# EAGLE design GPV1 (EAGLE 7.6.0)

## Sheet 1 of 4: Power Supply Circuit
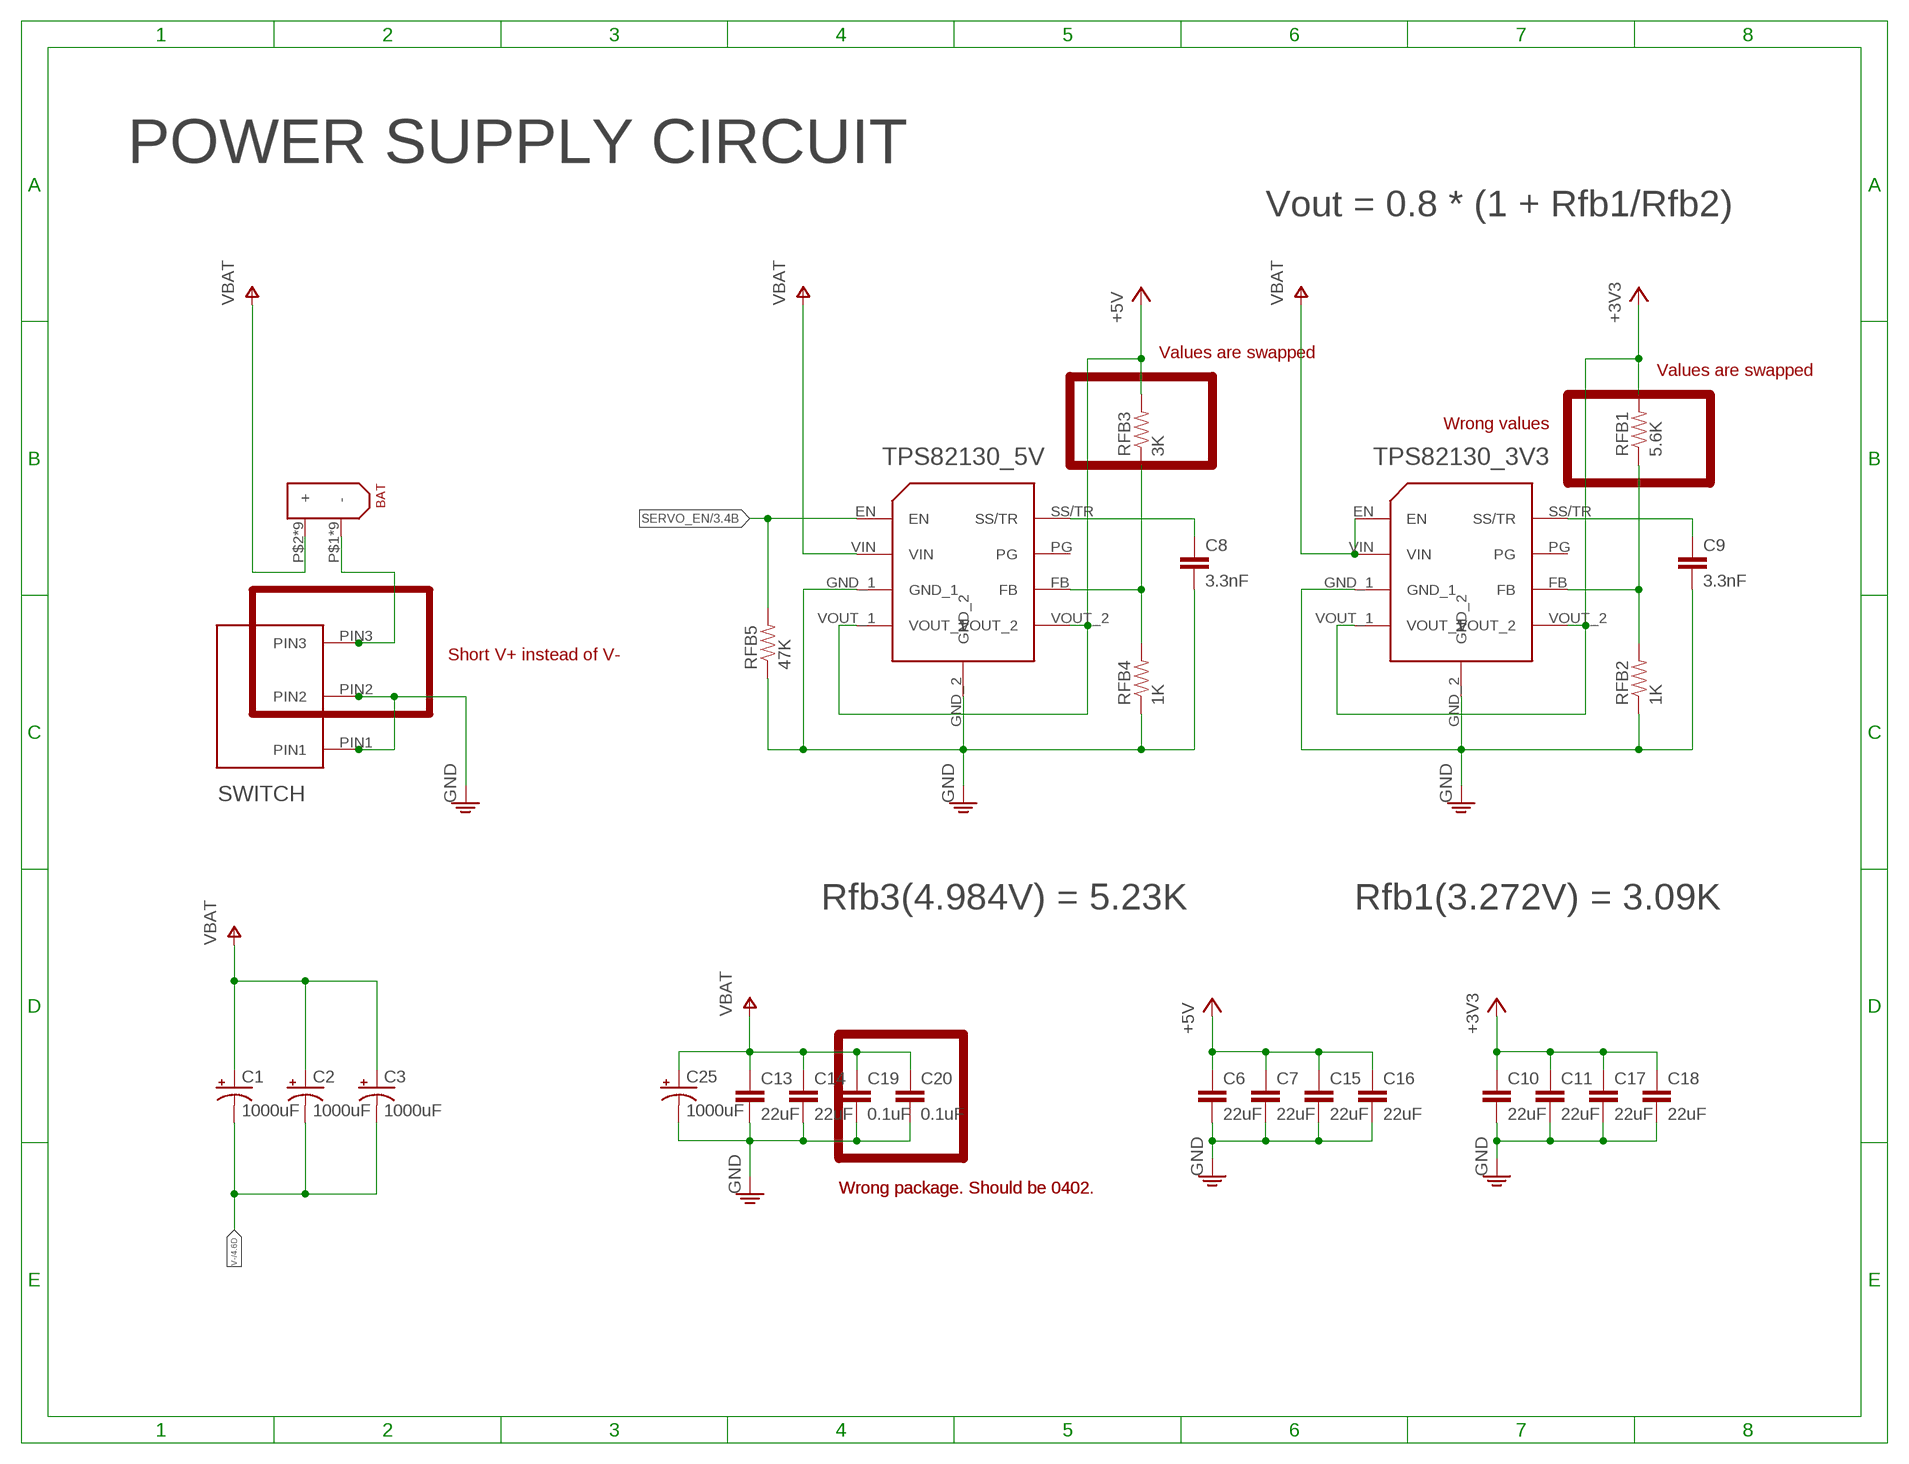
[diagram p0: schematic, sheet 1]

### Parts
BAT  XT-60  [XT-60]
C1  1000uF  CAP_POLH13  [PANASONIC_H13]
C2  1000uF  CAP_POLH13  [PANASONIC_H13]
C3  1000uF  CAP_POLH13  [PANASONIC_H13]
C6  22uF  CAP0805  [0805]
C7  22uF  CAP0805  [0805]
C8  3.3nF  CAP0402-CAP  [0402-CAP]
C9  3.3nF  CAP0402-CAP  [0402-CAP]
C10  22uF  CAP0805  [0805]
C11  22uF  CAP0805  [0805]
C13  22uF  CAP0805  [0805]
C14  22uF  CAP0805  [0805]
C15  22uF  CAP0805  [0805]
C16  22uF  CAP0805  [0805]
C17  22uF  CAP0805  [0805]
C18  22uF  CAP0805  [0805]
C19  0.1uF  CAP0805  [0805]
C20  0.1uF  CAP0805  [0805]
C25  1000uF  CAP_POLH13  [PANASONIC_H13]
ON<-->OFF  TS02_SWITCH  [TS02_SWITCH]
RFB1  5.6K  RESISTOR0402-RES  [0402-RES]
RFB2  1K  RESISTOR0402-RES  [0402-RES]
RFB3  3K  RESISTOR0402-RES  [0402-RES]
RFB4  1K  RESISTOR0402-RES  [0402-RES]
RFB5  47K  RESISTOR0402-RES  [0402-RES]
TPS82130_3V3  TPS82130  [TPS82130]
TPS82130_5V  TPS82130  [TPS82130]

### Nets
+3V3: C10.1 C11.1 C17.1 C18.1 RFB1.2 TPS82130_3V3.VOUT_1 TPS82130_3V3.VOUT_2 ; also sheet 2,3,4
+5V: C6.1 C7.1 C15.1 C16.1 RFB3.2 TPS82130_5V.VOUT_1 TPS82130_5V.VOUT_2 ; also sheet 3
GND: C6.2 C7.2 C8.2 C9.2 C10.2 C11.2 C13.2 C14.2 C15.2 C16.2 C17.2 C18.2 C19.2 C20.2 C25.- ON<-->OFF.PIN1 ON<-->OFF.PIN2 RFB2.1 RFB4.1 RFB5.1 TPS82130_3V3.GND_1 TPS82130_3V3.GND_2 TPS82130_5V.GND_1 TPS82130_5V.GND_2 ; also sheet 2,3,4
N$2: C9.1 TPS82130_3V3.SS/TR
N$16: RFB1.1 RFB2.2 TPS82130_3V3.FB
N$29: C8.1 TPS82130_5V.SS/TR
N$32: RFB3.1 RFB4.2 TPS82130_5V.FB
SERVO_EN: RFB5.2 TPS82130_5V.EN ; also sheet 3
V+: BAT.P$2(+) BAT.P$7(+) BAT.P$8(+) BAT.P$9(+) BAT.P$10(+) BAT.P$11(+) BAT.P$12(+) BAT.P$13(+) BAT.P$14(+) C1.+ C2.+ C3.+ C13.1 C14.1 C19.1 C20.1 C25.+ TPS82130_3V3.EN TPS82130_3V3.VIN TPS82130_5V.VIN ; supply symbol labelled VBAT ; also sheet 3,4
V-: BAT.P$1(-) BAT.P$3(-) BAT.P$4(-) BAT.P$5(-) BAT.P$6(-) BAT.P$15(-) BAT.P$16(-) BAT.P$17(-) BAT.P$18(-) C1.- C2.- C3.- ON<-->OFF.PIN3 ; also sheet 4
Unconnected: TPS82130_3V3.PG TPS82130_5V.PG

### Notes on the sheet
- POWER SUPPLY CIRCUIT
- Vout = 0.8 * (1 + Rfb1/Rfb2)
- Values are swapped
- Values are swapped
- Wrong values
- Short V+ instead of V-
- Rfb3(4.984V) = 5.23K | Rfb1(3.272V) = 3.09K
- Wrong package. Should be 0402 | Wrong package. Should be 0402.

## Sheet 2 of 4: Pushbuttons and LEDs
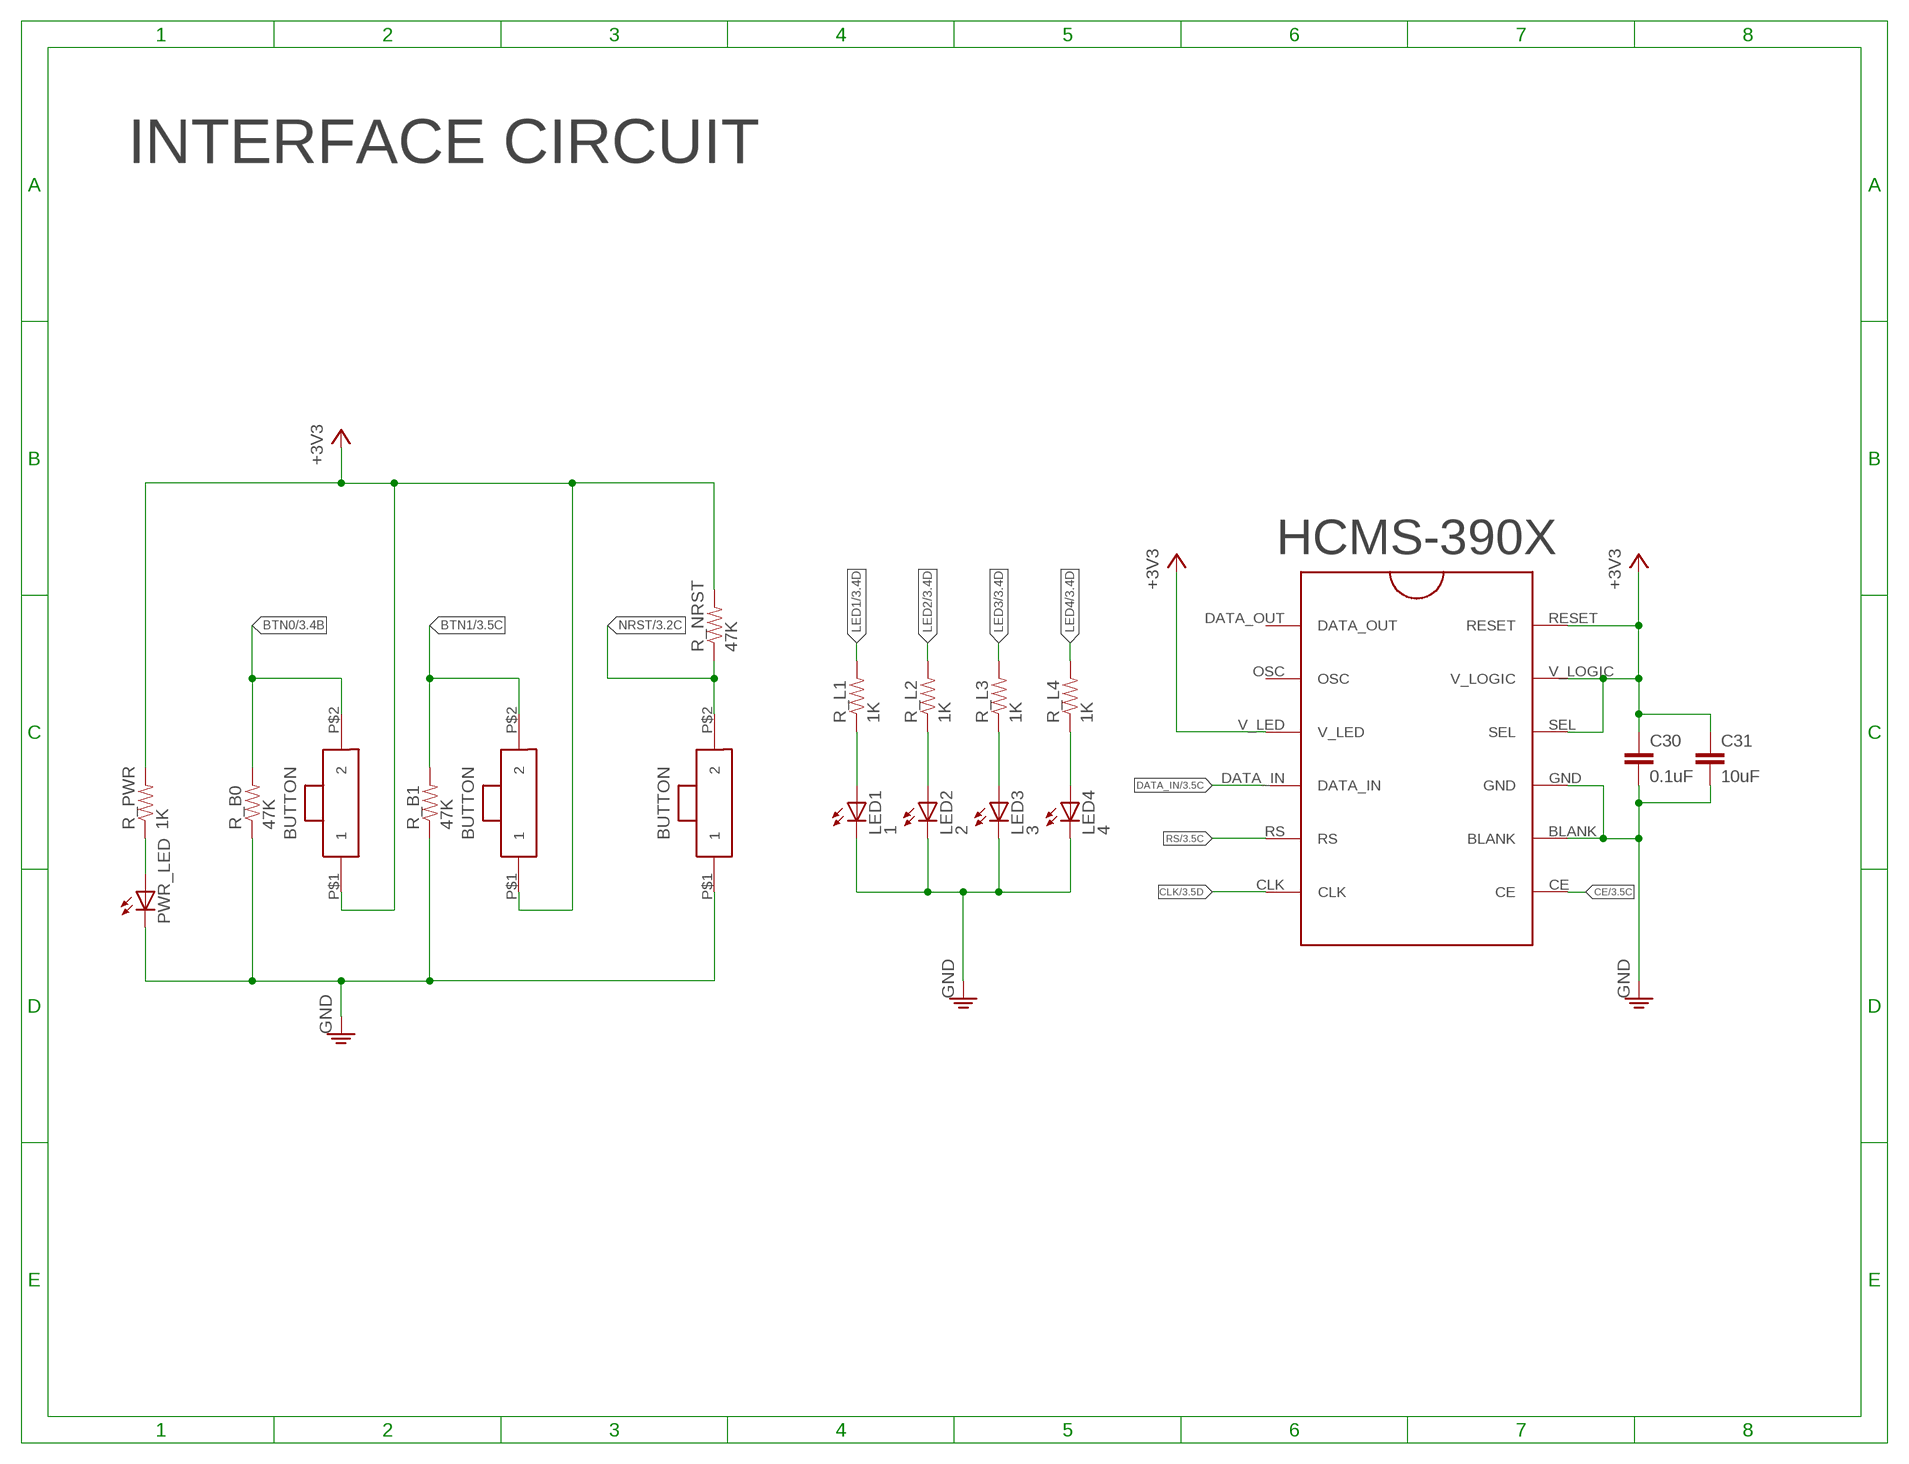
[diagram p1: schematic, sheet 2]

### Parts
BTN0  POLOLU_BUTTON  [POLOLU_BUTTON]
BTN1  POLOLU_BUTTON  [POLOLU_BUTTON]
C30  0.1uF  CAP0402-CAP  [0402-CAP]
C31  10uF  CAP0402-CAP  [0402-CAP]
HCMS-390X  HCMS-390X  HCMS-2903  [HCMS-2903]
LED1  1  LED0603  [LED-0603]
LED2  2  LED0603  [LED-0603]
LED3  3  LED0603  [LED-0603]
LED4  4  LED0603  [LED-0603]
PWR_LED  LED0603  [LED-0603]
R_B0  47K  RESISTOR0402-RES  [0402-RES]
R_B1  47K  RESISTOR0402-RES  [0402-RES]
R_L1  1K  RESISTOR0402-RES  [0402-RES]
R_L2  1K  RESISTOR0402-RES  [0402-RES]
R_L3  1K  RESISTOR0402-RES  [0402-RES]
R_L4  1K  RESISTOR0402-RES  [0402-RES]
R_NRST  47K  RESISTOR0402-RES  [0402-RES]
R_PWR  1K  RESISTOR0402-RES  [0402-RES]
RESET  NRST  POLOLU_BUTTON  [POLOLU_BUTTON]

### Nets
+3V3: BTN0.P$1 BTN1.P$1 C30.1 C31.1 HCMS-390X.RESET HCMS-390X.SEL HCMS-390X.V_LED HCMS-390X.V_LOGIC R_NRST.2 R_PWR.2 ; also sheet 1,3,4
BTN0: BTN0.P$2 R_B0.2 ; also sheet 3
BTN1: BTN1.P$2 R_B1.2 ; also sheet 3
CE: HCMS-390X.CE ; also sheet 3
CLK: HCMS-390X.CLK ; also sheet 3
DATA_IN: HCMS-390X.DATA_IN ; also sheet 3
GND: C30.2 C31.2 HCMS-390X.BLANK HCMS-390X.GND LED1.C LED2.C LED3.C LED4.C PWR_LED.C R_B0.1 R_B1.1 RESET.P$1 ; also sheet 1,3,4
LED1: R_L1.2 ; also sheet 3
LED2: R_L2.2 ; also sheet 3
LED3: R_L3.2 ; also sheet 3
LED4: R_L4.2 ; also sheet 3
N$1: PWR_LED.A R_PWR.1
N$4: LED1.A R_L1.1
N$7: LED2.A R_L2.1
N$8: LED3.A R_L3.1
N$11: LED4.A R_L4.1
NRST: R_NRST.1 RESET.P$2 ; also sheet 3
RS: HCMS-390X.RS ; also sheet 3
Unconnected: HCMS-390X.DATA_OUT HCMS-390X.OSC

### Notes on the sheet
- INTERFACE CIRCUIT

## Sheet 3 of 4: Microcontroller Circuit
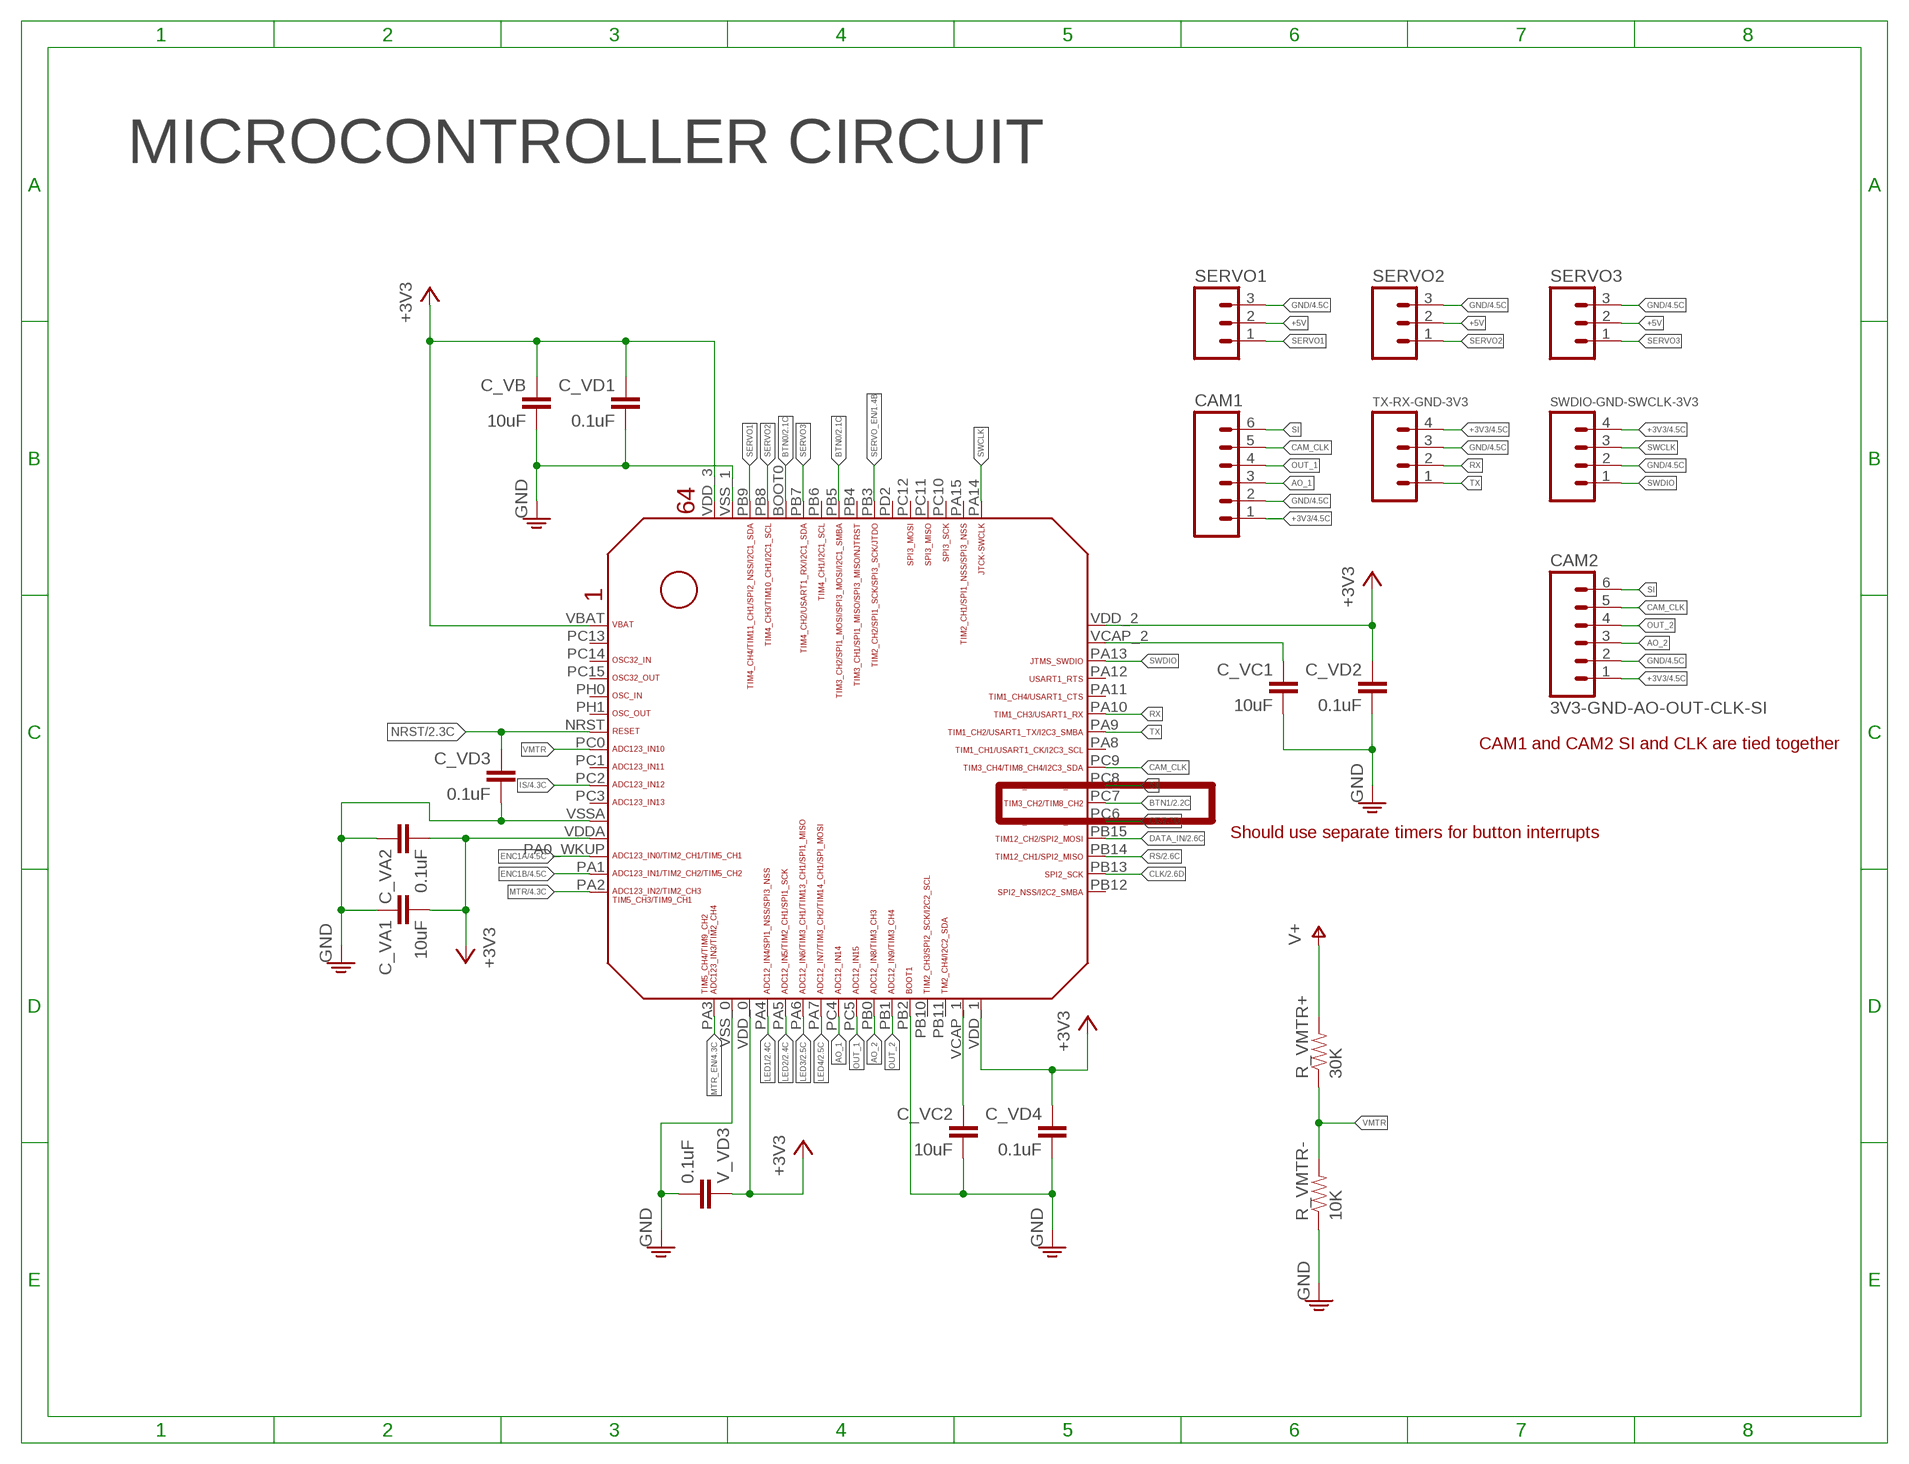
[diagram p2: schematic, sheet 3]

### Parts
C_VA1  10uF  CAP0402-CAP  [0402-CAP]
C_VA2  0.1uF  CAP0402-CAP  [0402-CAP]
C_VB  10uF  CAP0402-CAP  [0402-CAP]
C_VC1  10uF  CAP0402-CAP  [0402-CAP]
C_VC2  10uF  CAP0402-CAP  [0402-CAP]
C_VD1  0.1uF  CAP0402-CAP  [0402-CAP]
C_VD2  0.1uF  CAP0402-CAP  [0402-CAP]
C_VD3  0.1uF  CAP0402-CAP  [0402-CAP]
C_VD4  0.1uF  CAP0402-CAP  [0402-CAP]
CAM1  M06SIP  [1X06]
CAM2  3V3-GND-AO-OUT-CLK-SI  M06SIP  [1X06]
R_VMTR+  30K  RESISTOR0402-RES  [0402-RES]
R_VMTR-  10K  RESISTOR0402-RES  [0402-RES]
SERVO1  M03PTH  [1X03]
SERVO2  M03PTH  [1X03]
SERVO3  M03PTH  [1X03]
STM32F4X5RG  STM32F405/415_LQFP64  [STM32F405/415_LQFP64]
SWDIO-GND-SWCLK-3V3  M04PTH  [1X04]
TX-RX-GND-3V3  M04PTH  [1X04]
V_VD3  0.1uF  CAP0402-CAP  [0402-CAP]

### Nets
+3V3: C_VA1.2 C_VA2.2 C_VB.1 C_VD1.1 C_VD2.1 C_VD4.1 CAM1.1 CAM2.1 STM32F4X5RG.VBAT STM32F4X5RG.VDD_0 STM32F4X5RG.VDD_1 STM32F4X5RG.VDD_2 STM32F4X5RG.VDD_3 STM32F4X5RG.VDDA SWDIO-GND-SWCLK-3V3.4 TX-RX-GND-3V3.4 V_VD3.1 ; also sheet 1,2,4
+5V: SERVO1.2 SERVO2.2 SERVO3.2 ; also sheet 1
AO_1: CAM1.3 STM32F4X5RG.PC4
AO_2: CAM2.3 STM32F4X5RG.PB0
BTN0: STM32F4X5RG.BOOT0 STM32F4X5RG.PB5 ; also sheet 2
BTN1: STM32F4X5RG.PC7 ; also sheet 2
CAM_CLK: CAM1.5 CAM2.5 STM32F4X5RG.PC9
CE: STM32F4X5RG.PC6 ; also sheet 2
CLK: STM32F4X5RG.PB13 ; also sheet 2
DATA_IN: STM32F4X5RG.PB15 ; also sheet 2
ENC1A: STM32F4X5RG.PA0_WKUP(PA0_AKUP) ; also sheet 4
ENC1B: STM32F4X5RG.PA1 ; also sheet 4
GND: C_VA1.1 C_VA2.1 C_VB.2 C_VC1.2 C_VC2.2 C_VD1.2 C_VD2.2 C_VD3.2 C_VD4.2 CAM1.2 CAM2.2 R_VMTR-.1 SERVO1.3 SERVO2.3 SERVO3.3 STM32F4X5RG.PB2 STM32F4X5RG.VSS_0 STM32F4X5RG.VSS_1 STM32F4X5RG.VSSA SWDIO-GND-SWCLK-3V3.2 TX-RX-GND-3V3.3 V_VD3.2 ; also sheet 1,2,4
IS: STM32F4X5RG.PC2 ; also sheet 4
LED1: STM32F4X5RG.PA4 ; also sheet 2
LED2: STM32F4X5RG.PA5 ; also sheet 2
LED3: STM32F4X5RG.PA6 ; also sheet 2
LED4: STM32F4X5RG.PA7 ; also sheet 2
MTR: STM32F4X5RG.PA2 ; also sheet 4
MTR_EN: STM32F4X5RG.PA3 ; also sheet 4
N$64: C_VC2.1 STM32F4X5RG.VCAP_1
N$68: C_VC1.1 STM32F4X5RG.VCAP_2
NRST: C_VD3.1 STM32F4X5RG.NRST ; also sheet 2
OUT_1: CAM1.4 STM32F4X5RG.PC5
OUT_2: CAM2.4 STM32F4X5RG.PB1
RS: STM32F4X5RG.PB14 ; also sheet 2
RX: STM32F4X5RG.PA10 TX-RX-GND-3V3.2
SERVO1: SERVO1.1 STM32F4X5RG.PB9
SERVO2: SERVO2.1 STM32F4X5RG.PB8
SERVO3: SERVO3.1 STM32F4X5RG.PB7
SERVO_EN: STM32F4X5RG.PB3 ; also sheet 1
SI: CAM1.6 CAM2.6 STM32F4X5RG.PC8
SWCLK: STM32F4X5RG.PA14 SWDIO-GND-SWCLK-3V3.3
SWDIO: STM32F4X5RG.PA13 SWDIO-GND-SWCLK-3V3.1
TX: STM32F4X5RG.PA9 TX-RX-GND-3V3.1
V+: R_VMTR+.2 ; also sheet 1,4
VMTR: R_VMTR+.1 R_VMTR-.2 STM32F4X5RG.PC0
Unconnected: STM32F4X5RG.PA8 STM32F4X5RG.PA11 STM32F4X5RG.PA12 STM32F4X5RG.PA15 STM32F4X5RG.PB4 STM32F4X5RG.PB6 STM32F4X5RG.PB10 STM32F4X5RG.PB11 STM32F4X5RG.PB12 STM32F4X5RG.PC1 STM32F4X5RG.PC3 STM32F4X5RG.PC10 STM32F4X5RG.PC11 STM32F4X5RG.PC12 STM32F4X5RG.PC13 STM32F4X5RG.PC14 STM32F4X5RG.PC15 STM32F4X5RG.PD2 STM32F4X5RG.PH0 STM32F4X5RG.PH1

### Notes on the sheet
- MICROCONTROLLER CIRCUIT
- CAM1 and CAM2 SI and CLK are tied together
- Should use separate timers for button interrupts

## Sheet 4 of 4: Motor Control Circuit
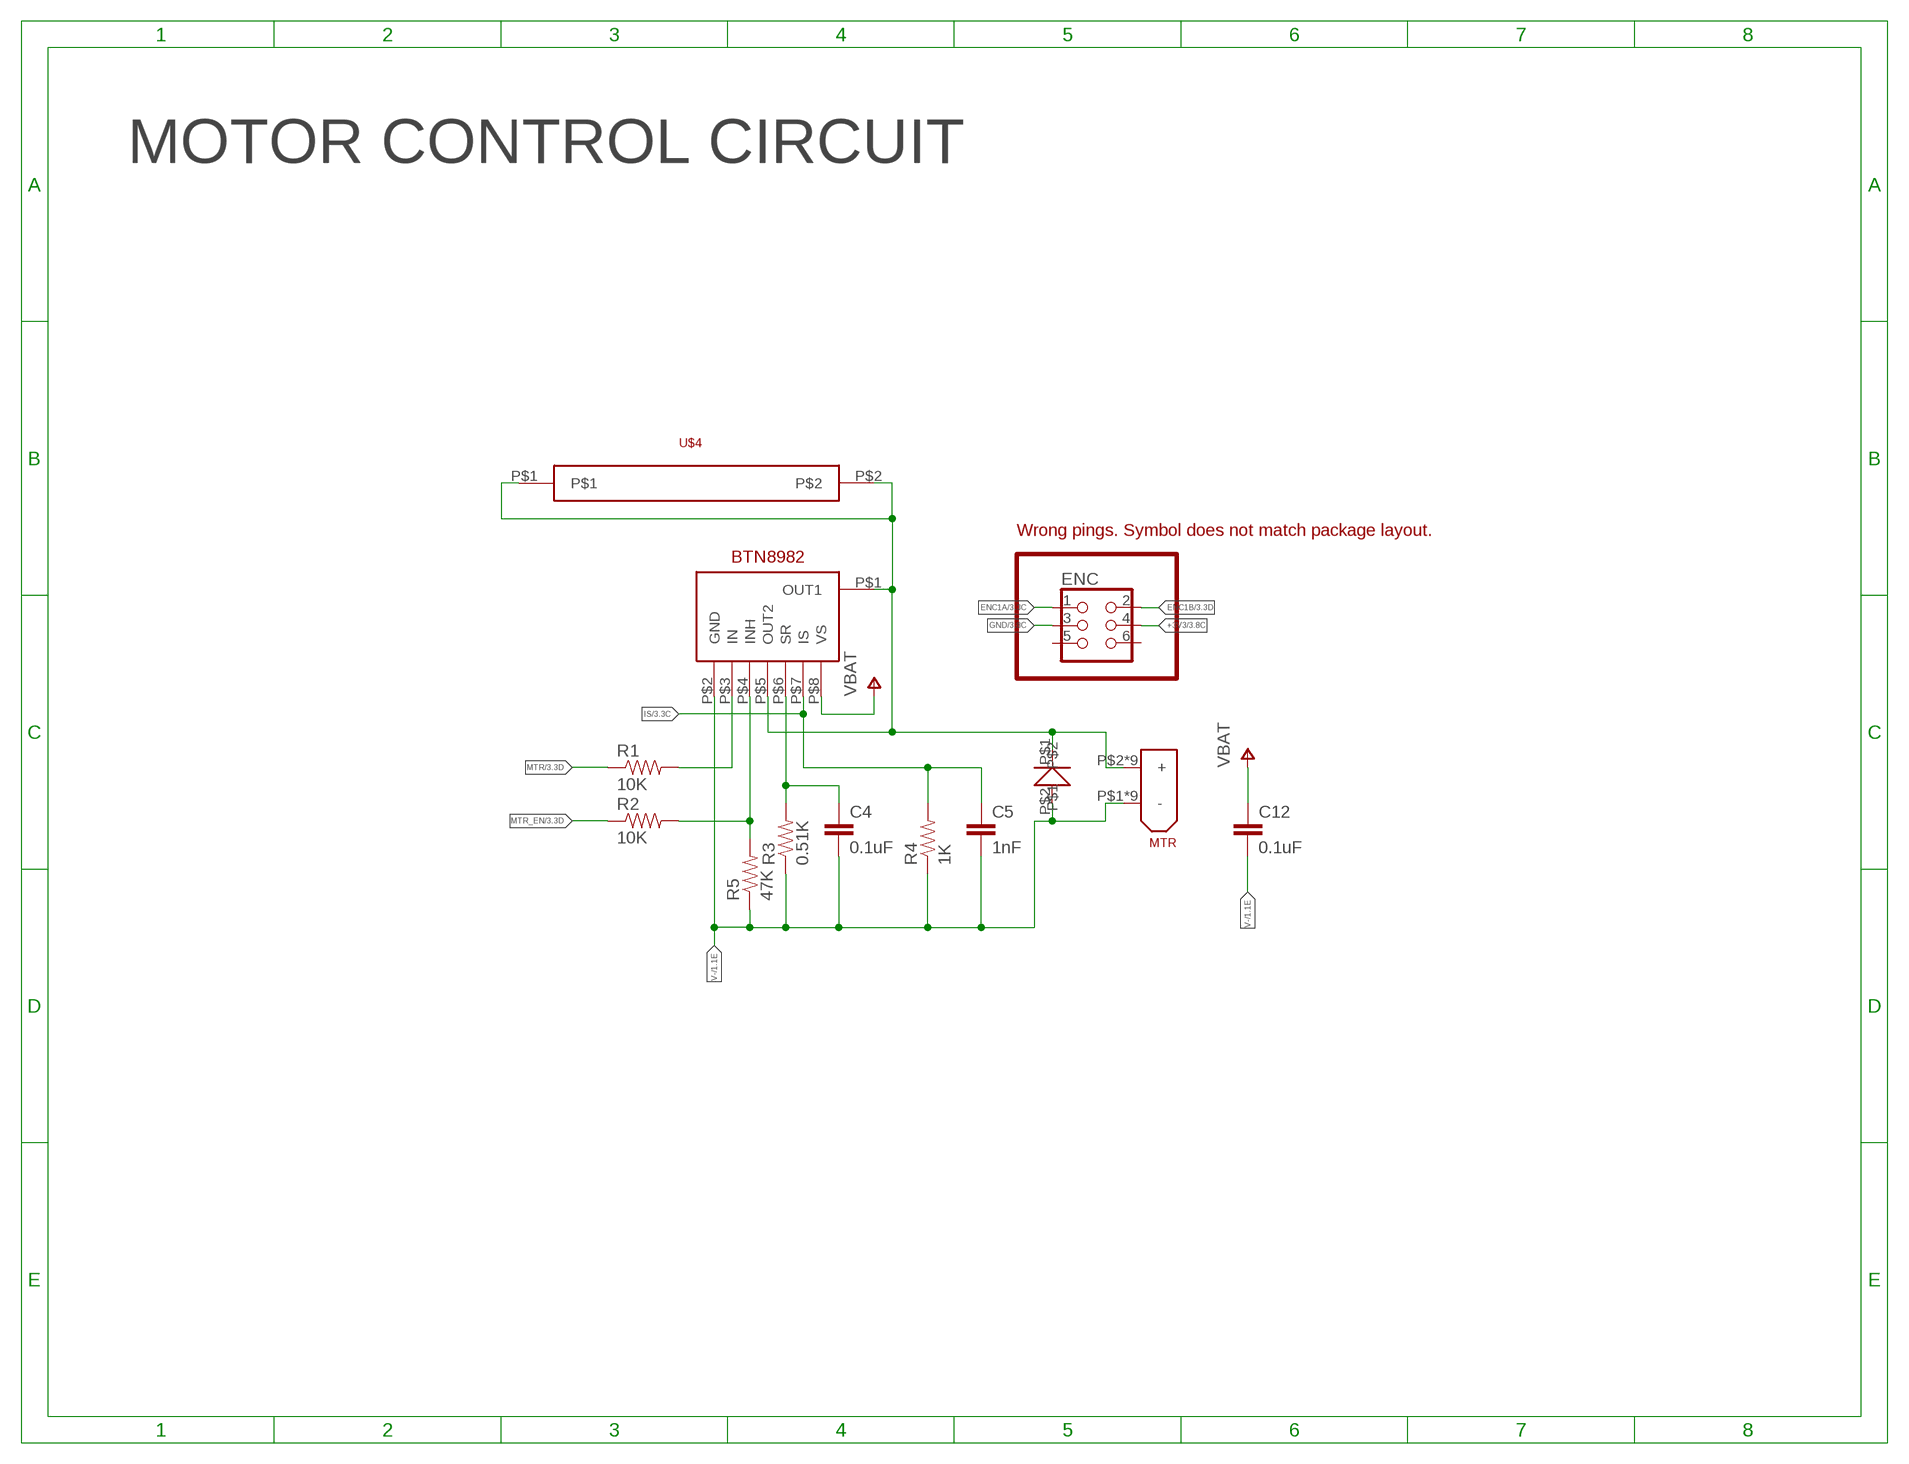
[diagram p3: schematic, sheet 4]

### Parts
BTN8982  BTN8982  [BTN8982]
C4  0.1uF  CAP0402-CAP  [0402-CAP]
C5  1nF  CAP0402-CAP  [0402-CAP]
C12  0.1uF  CAP0402-CAP  [0402-CAP]
DIODE  DIODE_DO-214AB  [DO-214AB]
ENC  PINHD-2X31  [DIN-41651]
MTR  XT-60  [XT-60]
R1  10K  RESISTOR0402-RES  [0402-RES]
R2  10K  RESISTOR0402-RES  [0402-RES]
R3  0.51K  RESISTOR0402-RES  [0402-RES]
R4  1K  RESISTOR0402-RES  [0402-RES]
R5  47K  RESISTOR0402-RES  [0402-RES]
U$4  HEATSINK_TO-263  [HEATSINK_TO-263]

### Nets
+3V3: ENC.4 ; also sheet 1,2,3
ENC1A: ENC.1 ; also sheet 3
ENC1B: ENC.2 ; also sheet 3
GND: ENC.3 ; also sheet 1,2,3
IS: BTN8982.P$7(IS) C5.1 R4.2 ; also sheet 3
MTR: R1.1 ; also sheet 3
MTR_EN: R2.1 ; also sheet 3
N$3: BTN8982.P$3(IN) R1.2
N$5: BTN8982.P$4(INH) R2.2 R5.2
N$6: BTN8982.P$6(SR) C4.1 R3.2
N$10: BTN8982.P$1(OUT1) BTN8982.P$5(OUT2) DIODE.P$1 MTR.P$2(+) MTR.P$7(+) MTR.P$8(+) MTR.P$9(+) MTR.P$10(+) MTR.P$11(+) MTR.P$12(+) MTR.P$13(+) MTR.P$14(+) U$4.P$1 U$4.P$2
V+: BTN8982.P$8(VS) C12.1 ; supply symbol labelled VBAT ; also sheet 1,3
V-: BTN8982.P$2(GND) C4.2 C5.2 C12.2 DIODE.P$2 MTR.P$1(-) MTR.P$3(-) MTR.P$4(-) MTR.P$5(-) MTR.P$6(-) MTR.P$15(-) MTR.P$16(-) MTR.P$17(-) MTR.P$18(-) R3.1 R4.1 R5.1 ; also sheet 1
Unconnected: ENC.5 ENC.6

### Notes on the sheet
- MOTOR CONTROL CIRCUIT
- Wrong pings. Symbol does not match package layout.

## Library data of the parts
BAT MTR = XT-60:XT-60
BTN0 BTN1 RESET = POLOLU BUTTON:POLOLU_BUTTON
BTN8982 = BTN8982:BTN8982
C1-C3 C25 = SPARKFUN:CAP_POL: Capacitor Polarized These are standard SMD and PTH capacitors. Normally 10uF, 47uF, and 100uF in electrolytic and tantalum varieties. Always verify the external diameter of the through hole cap, it varies with capacity, voltage, and manufacturer. The EIA devices should be standard.
C4-C20 C30 C31 C_VA1 C_VA2 C_VB C_VC1 C_VC2 C_VD1-C_VD4 V_VD3 = SPARKFUN:CAP: Capacitor Standard 0603 ceramic capacitor, and 0.1" leaded capacitor.
CAM1 CAM2 = SPARKFUN:M06: Header 6 Standard 6-pin 0.1" header. Use with straight break away headers (SKU : PRT-00116), right angle break away headers (PRT-00553), swiss pins (PRT-00743), machine pins (PRT-00117), and female headers (PRT-00115). Molex polarized connector foot print use with SKU : PRT-08094 with associated crimp pins and housings. NOTES ON THE VARIANTS LOCK and LOCK_LONGPADS... This footprint was designed to help hold the alignment of a through-hole component (i.e. 6-pin header) while soldering it into place. You may notice that each hole has been shifted either up or down by 0.005 of an inch from it's more standard position (which is a perfectly straight line). This slight alteration caused the pins (the squares in the middle) to touch the edges of the holes. Because they are alternating, it causes a "brace" to hold the component in place. 0.005 has proven to be the perfect amount of "off-center" position when using our standard breakaway headers. Although looks a little odd when you look at the bare footprint, once you have a header in there, the alteration is very hard to notice. Also, if you push a header all the way into place, it is covered up entirely on the bottom side. This idea of altering the position of holes to aid alignment will be further integrated into the Sparkfun Library for other footprints. It can help hold any component with 3 or more connection pins.
DIODE = DIODE_DO-214AB:DIODE_DO-214AB
ENC = SPARKFUN:PINHD-2X3: PIN HEADER
HCMS-390X = HCMS-2903:HCMS-2903
LED1-LED4 PWR_LED = SPARKFUN:LED: LEDs Standard schematic elements and footprints for 5mm, 3mm, 1206, and 0603 sized LEDs. 5mm - Spark Fun Electronics SKU : COM-00529 (and others)
ON<-->OFF = SLIDE SWITCH 0.185 PITCH:TS02_SWITCH
R1-R5 R_B0 R_B1 R_L1-R_L4 R_NRST R_PWR R_VMTR+ R_VMTR- RFB1-RFB5 = SPARKFUN:RESISTOR: Resistor Basic schematic elements and footprints for 0603, 1206, and PTH resistors.
SERVO1-SERVO3 = SPARKFUN:M03: Header 3 Standard 3-pin 0.1" header. Use with straight break away headers (SKU : PRT-00116), right angle break away headers (PRT-00553), swiss pins (PRT-00743), machine pins (PRT-00117), and female headers (PRT-00115). Molex polarized connector foot print use with SKU : PRT-08232 with associated crimp pins and housings.
STM32F4X5RG = STM32F405RG:STM32F405/415_LQFP64
SWDIO-GND-SWCLK-3V3 TX-RX-GND-3V3 = SPARKFUN:M04: Header 4 Standard 4-pin 0.1" header. Use with straight break away headers (SKU : PRT-00116), right angle break away headers (PRT-00553), swiss pins (PRT-00743), machine pins (PRT-00117), and female headers (PRT-00115). Molex polarized connector foot print use with SKU : PRT-08231 with associated crimp pins and housings. 1MM SMD Version SKU: PRT-10208
TPS82130_3V3 TPS82130_5V = TPS82130:TPS82130
U$4 = HEATSINK_TO-263:HEATSINK_TO-263

## Board
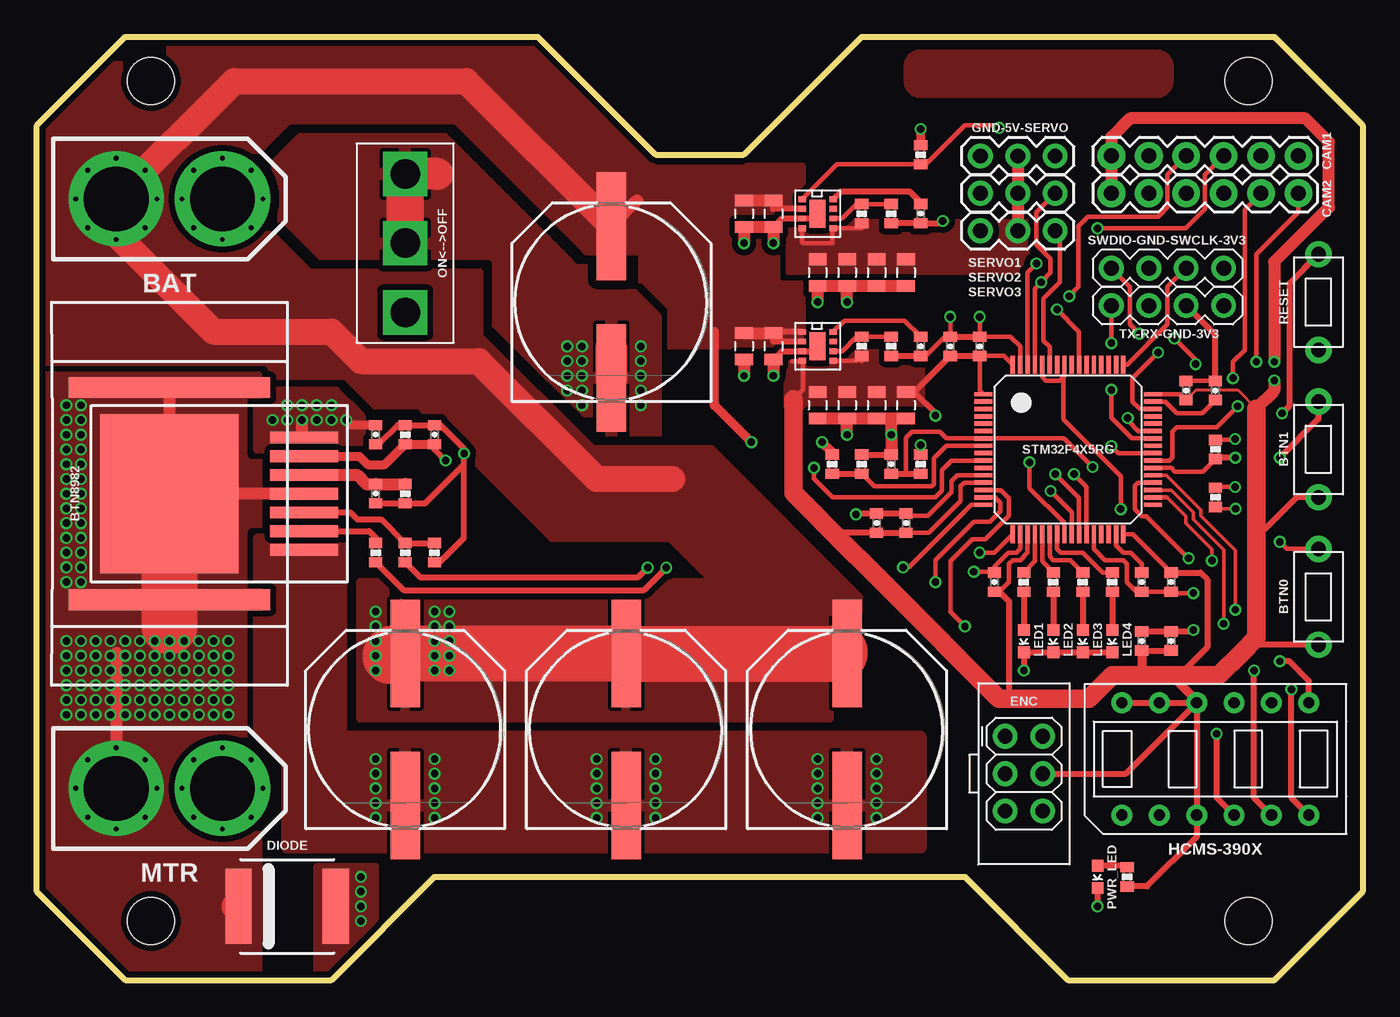
[diagram p4: board, top side]
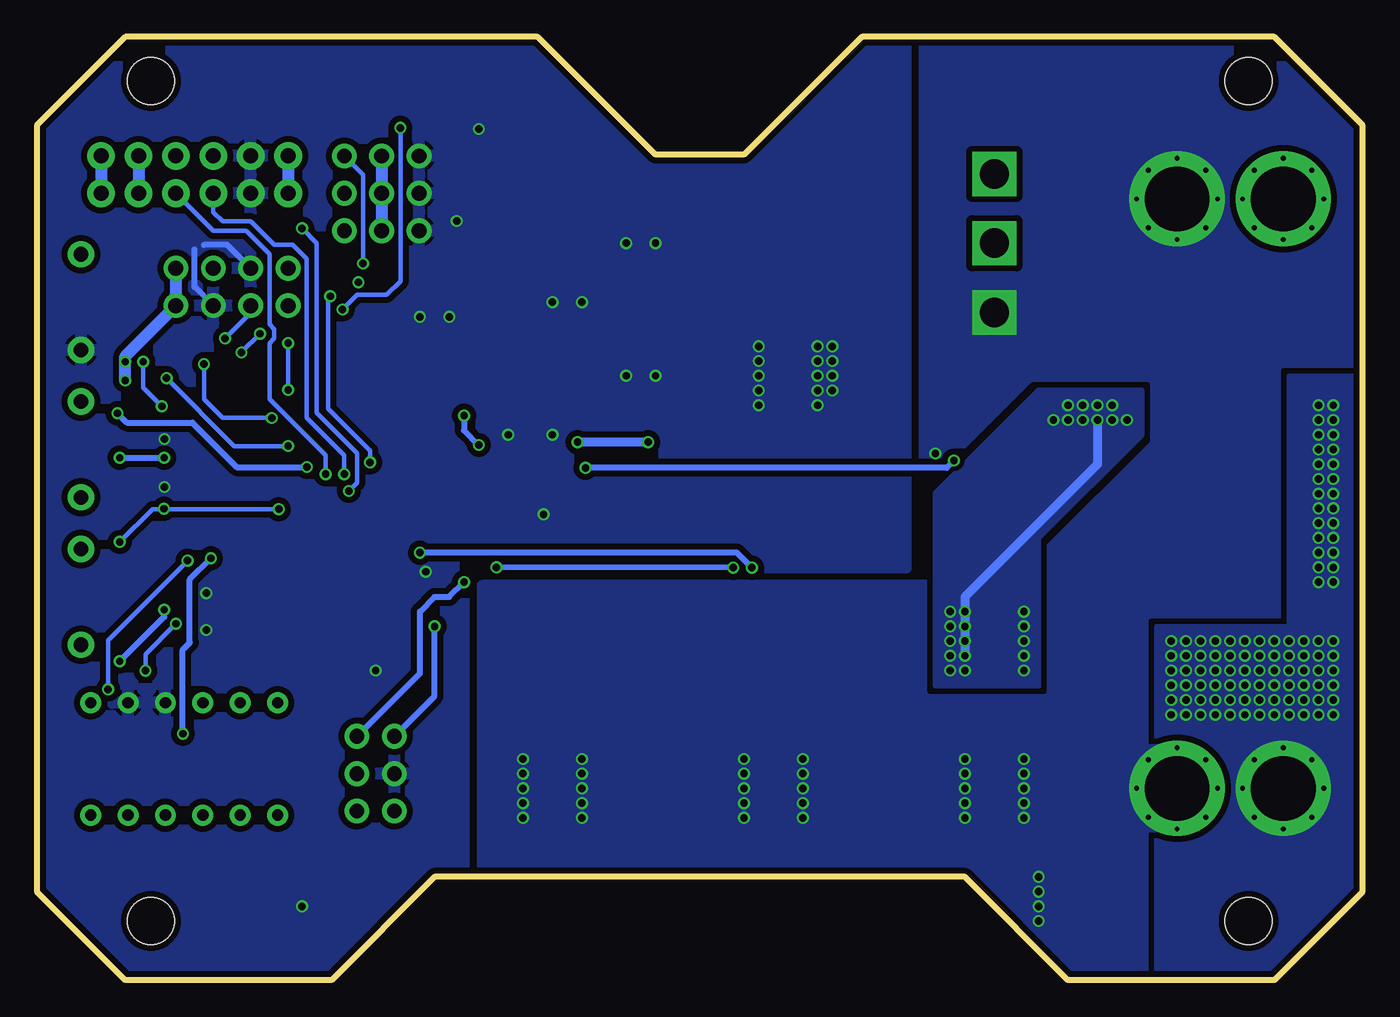
[diagram p5: board, bottom side, seen from below]

Size 90 x 64 mm. Coordinates in mm from the lower left corner, seen from the top.
Outline: 90,58 90,6 84,0 70,0 63,7 27,7 20,0 6,0 0,6 0,58 6,64 34,64 42,56 48,56 56,64 84,64 90,58
Copper layers (1*16): Top 0.035mm / dielectric 1.5mm / Bottom 0.035mm
Design rules "ITead_rule": minimum track width 6mil, minimum drill 12mil, track to track 6mil, track to pad 6mil, pad to pad 6mil, via to via 6mil, smd to smd 0mil, copper to edge 10mil, drill to drill 10mil, minimum pad ring 10mil, minimum via ring 6mil, stop-mask expansion 2mil, vias tented up to drill 100mil, thermal gap 10mil
Holes 3.2 mm at 7.75,61 82.25,61 7.75,4 82.25,4

### Footprints (pad centres in the part's own frame; a part is rotated, then mirrored left to right if it is on the bottom)
XT-60 = drill 4.4 pad 6.452: P$1 0,3.6; P$2 0,-3.6 | drill 0.33: P$3 2.75,3.6; P$4 -2.75,3.6; P$5 0,6.35; P$6 0,0.85; P$7 2.75,-3.6; P$8 -2.75,-3.6; P$9 0,-0.85; P$10 0,-6.35; P$11 1.945,-1.655; P$12 -1.945,-5.545; P$13 -1.945,-1.655; P$14 1.945,-5.545; P$15 1.945,5.545; P$16 -1.945,1.655; P$17 -1.945,5.545; P$18 1.945,1.655
POLOLU_BUTTON = drill 1 pad 1.778: P$1 -3.25,0; P$2 3.25,0
BTN8982 = smd 10.8 x 9.4: P$1 0,0 | smd 0.8 x 4.6: P$2 -3.81,-9.15; P$3 -2.54,-9.15; P$4 -1.27,-9.15; P$5 0,-9.15; P$6 1.27,-9.15; P$7 2.54,-9.15; P$8 3.81,-9.15
PANASONIC_H13 = smd 7.3 x 2: + 5.15,0; - -5.15,0
0402-CAP = smd 0.7 x 0.9: 1 -0.65,0; 2 0.65,0
0805 = smd 0.8 x 1.2: 1 -0.9,0; 2 0.9,0
1X06 = drill 1.016 pad 1.88: 1 0,0; 2 2.54,0; 3 5.08,0; 4 7.62,0; 5 10.16,0; 6 12.7,0
DO-214AB = smd 1.778 x 5.08: P$1 -3.302,0; P$2 3.302,0
DIN-41651 = drill 1 pad 1.676: 1 -2.54,-1.27; 2 -2.54,1.27; 3 0,-1.27; 4 0,1.27; 5 2.54,-1.27; 6 2.54,1.27
HCMS-2903 = drill 0.762 pad 1.422: BLANK 3.81,3.81; CE 6.35,3.81; CLK 6.35,-3.81; DATA_IN 1.27,-3.81; DATA_OUT -6.35,-3.81; GND 1.27,3.81; OSC -3.81,-3.81; RESET -6.35,3.81; RS 3.81,-3.81; SEL -1.27,3.81; V_LED -1.27,-3.81; V_LOGIC -3.81,3.81
LED-0603 = smd 0.8 x 0.8: A 0,-0.75; C 0,0.75
TS02_SWITCH = drill 2 square: PIN1 -4.699,0; PIN2 0,0; PIN3 4.699,0
0402-RES = smd 0.7 x 0.9: 1 -0.65,0; 2 0.65,0
1X03 = drill 1 pad 1.676: 1 0,0; 2 2.54,0; 3 5.08,0
STM32F405/415_LQFP64 = smd 0.3 x 1.2: BOOT0 -1.75,5.75; PA3 -3.75,-5.75; PA4 -2.25,-5.75; PA5 -1.75,-5.75; PA6 -1.25,-5.75; PA7 -0.75,-5.75; PA14 3.75,5.75; PA15 3.25,5.75; PB0 0.75,-5.75; PB1 1.25,-5.75; PB2 1.75,-5.75; PB3 0.75,5.75; PB4 0.25,5.75; PB5 -0.25,5.75; PB6 -0.75,5.75; PB7 -1.25,5.75; PB8 -2.25,5.75; PB9 -2.75,5.75; PB10 2.25,-5.75; PB11 2.75,-5.75; PC4 -0.25,-5.75; PC5 0.25,-5.75; PC10 2.75,5.75; PC11 2.25,5.75; PC12 1.75,5.75; PD2 1.25,5.75; VCAP_1 3.25,-5.75; VDD_0 -2.75,-5.75; VDD_1 3.75,-5.75; VDD_3 -3.75,5.75; VSS_0 -3.25,-5.75; VSS_1 -3.25,5.75 | smd 1.2 x 0.3: NRST -5.75,0.75; PA0_WKUP -5.75,-2.75; PA1 -5.75,-3.25; PA2 -5.75,-3.75; PA8 5.75,0.25; PA9 5.75,0.75; PA10 5.75,1.25; PA11 5.75,1.75; PA12 5.75,2.25; PA13 5.75,2.75; PB12 5.75,-3.75; PB13 5.75,-3.25; PB14 5.75,-2.75; PB15 5.75,-2.25; PC0 -5.75,0.25; PC1 -5.75,-0.25; PC2 -5.75,-0.75; PC3 -5.75,-1.25; PC6 5.75,-1.75; PC7 5.75,-1.25; PC8 5.75,-0.75; PC9 5.75,-0.25; PC13 -5.75,3.25; PC14 -5.75,2.75; PC15 -5.75,2.25; PH0 -5.75,1.75; PH1 -5.75,1.25; VBAT -5.75,3.75; VCAP_2 5.75,3.25; VDD_2 5.75,3.75; VDDA -5.75,-2.25; VSSA -5.75,-1.75
1X04 = drill 1.016 pad 1.676: 1 0,0; 2 2.54,0; 3 5.08,0; 4 7.62,0
TPS82130 = smd 0.5 x 0.4: EN -1.05,0.975; FB 1.05,-0.325; GND_1 -1.05,-0.325; PG 1.05,0.325; SS/TR 1.05,0.975; VIN -1.05,0.325; VOUT_1 -1.05,-0.975; VOUT_2 1.05,-0.975 | smd 1.1 x 1.9: GND_2 0,0
HEATSINK_TO-263 = smd 1.4 x 13.7: P$1 -7.2,0; P$2 7.2,0

### Placement (x,y rotation side)
BAT  9,53 270 top
BTN0  87,26 90 top
BTN1  87,36 90 top
BTN8982  9,33 90 top
C1  25,17 90 top
C2  55,17 90 top
C3  40,17 90 top
C4  23,33 270 top
C5  27,37 90 top
C6  53,48 270 top
C7  55,48 270 top
C8  60,52 270 top
C9  60,43 270 top
C10  53,39 270 top
C11  55,39 270 top
C12  23,37 270 top
C13  48,43 270 top
C14  48,52 270 top
C15  57,48 270 top
C16  59,48 270 top
C17  57,39 270 top
C18  59,39 270 top
C19  50,52 270 top
C20  50,43 270 top
C25  39,46 90 top
C30  75,23 90 top
C31  77,23 90 top
C_VA1  57,31 270 top
C_VA2  59,31 270 top
C_VB  62,43 90 top
C_VC1  80,40 90 top
C_VC2  75,27 270 top
C_VD1  64,43 90 top
C_VD2  78,40 90 top
C_VD3  58,35 90 top
C_VD4  77,27 270 top
CAM1  72.94,55.92 0 top
CAM2  72.94,53.38 0 top
DIODE  17,5 0 top
ENC  67,14 270 top
HCMS-390X  80,15 0 top
LED1  67,23 180 top
LED2  69,23 180 top
LED3  71,23 180 top
LED4  73,23 180 top
MTR  9,13 270 top
ON<-->OFF  25,50 270 top
PWR_LED  72,7 180 top
R1  23,29 90 top
R2  25,29 90 top
R3  25,33 90 top
R4  25,37 270 top
R5  27,29 90 top
R_B0  80,32.75 270 top
R_B1  80,36 270 top
R_L1  67,27 90 top
R_L2  69,27 90 top
R_L3  71,27 90 top
R_L4  73,27 90 top
R_NRST  60,35 90 top
R_PWR  74,7 270 top
R_VMTR+  54,35 90 top
R_VMTR-  56,35 270 top
RESET  87,46 90 top
RFB1  56,43 270 top
RFB2  58,43 90 top
RFB3  56,52 270 top
RFB4  58,52 90 top
RFB5  60,56 270 top
SERVO1  69.13,55.92 180 top
SERVO2  69.13,53.38 180 top
SERVO3  69.13,50.84 180 top
STM32F4X5RG  70,36 0 top
SWDIO-GND-SWCLK-3V3  72.94,48.3 0 top
TPS82130_3V3  53,43 0 top
TPS82130_5V  53,52 0 top
TX-RX-GND-3V3  72.94,45.76 0 top
U$4  9,33 90 top
V_VD3  65,27 90 top

### Tracks (layer width: path | path; a pad name or v marks a point on that pad's centre or on a via)
+3V3  (via drill 0.5)
  Top 0.203: C_VD2.1 78.69,40.05 81.51,40.05 82.78,38.77
  Top 0.305: TPS82130_3V3.VOUT_1 51.98,42 | 51.98,42 52,42 52,40.06 51.35,39.41 | 54,42 54.02,42 TPS82130_3V3.VOUT_2 55.67,42.02 RFB1.2 56,42 | 51.98,42 51.25,42 | STM32F4X5RG.VDD_1 74.4,30.25 C_VD4.1 | STM32F4X5RG.VDD_0 67.25,29 66.75,28.5 66.25,28.5 66,28.25 66,27 65.35,26.35 V_VD3.1 | STM32F4X5RG.VDD_3 65.65,42.35 C_VD1.1 64,40 STM32F4X5RG.VBAT | C_VD2.1 77.6,39.75 STM32F4X5RG.VDD_2 | STM32F4X5RG.VDDA 62.95,33.75 62.7,33.5 62.7,32.5 60.55,30.35 C_VA2.2
  Top 0.406: R_PWR.2 75.35,6.35 78.73,9.73 HCMS-390X.V_LED HCMS-390X.SEL | C30.1 C31.1 | HCMS-390X.SEL HCMS-390X.V_LOGIC HCMS-390X.RESET | ENC.4 73.92,14 HCMS-390X.SEL | BTN0.P$1 82.31,22.75 81.78,22.22 | BTN1.P$1 85.53,32.75 82.78,30 | C18.1 59.55,39.9 | 59.55,39.9 C_VB.1 C_VD1.1 | 52.76,31.65 52.7,31.7 | C_VA2.2 C_VA1.2 54.06,30.35 53.7,30.7 | 82.78,36.37 82.78,36 | 58.06,26.35 57.7,26.7 | R_NRST.2 v60,36.3 | 59.55,39.9 61,38.45 v61,38.3 | 65.35,26.35 66,25.7 66,19.09 | C_VD4.1 78.98,27.65 79.45,27.19 79.45,22.58 77.54,20.68
  Top 0.61: C30.1 75,20.68 | HCMS-390X.SEL 78.73,18.95 77,20.68
  Top 0.813: v84,41.95 84,48.72 87.7,52.43 87.7,56.87 86.12,58.46 74.21,58.46 72.94,57.19 CAM2.1 | v84,40.68 84,40 82.78,38.78 82.78,38.77
  Top 1.27: 51.35,39.41 51.35,33.06 52.7,31.7 53.7,30.7 57.7,26.7 65.32,19.09 66,19.09 71.42,19.09 73.01,20.68 75,20.68 77,20.68 77.54,20.68 80.24,20.68 81.78,22.22 82.78,23.22 82.78,30 82.78,36 82.78,38.77
  Bottom 0.406: v61,38.3 61,37.3 v60,36.3
  Bottom 0.813: CAM1.1 CAM2.1 | SWDIO-GND-SWCLK-3V3.4 TX-RX-GND-3V3.4 84,42.32 v84,41.95 v84,40.68
  pour Top (isolate 0.406, no thermals): 51,42.5 51,39 60,39 60,42.5
+5V
  Top 0.305: TPS82130_5V.VOUT_1 51.95,50.05 52,50 54,50 54,51 | TPS82130_5V.VOUT_2 55.98,51.02 56,51
  Top 0.813: 66.6,55.9 66.6,50.8
  Bottom 0.813: SERVO1.2 SERVO2.2 SERVO3.2
  pour Top (isolate 0.406, no thermals): 51,51.5 68,51.5 68,48 51,48
AO_1  (via drill 0.5)
  Top 0.305: CAM1.3 76.75,54.65 76.75,52.43 76.11,51.79 71.35,51.79 70.72,51.16 70.72,47.03 v70.08,46.39 | v67.38,35.12 67.38,33.38 69.75,31.01 STM32F4X5RG.PC4
  Bottom 0.305: v70.08,46.39 70.24,46.24 70.24,38.77 67.38,35.92 v67.38,35.12
AO_2  (via drill 0.5)
  Top 0.305: STM32F4X5RG.PB0 70.75,32.71 v69.13,34.33
  Bottom 0.305: v69.13,34.33 69.13,35.6 71.67,38.14 71.67,48.94 72.62,49.89 73.89,49.89 75.48,51.48 77.38,51.48 78.02,52.11 CAM2.3
BTN0  (via drill 0.5)
  Top 0.254: v81.37,31.98 80.12,31.98 R_B0.2
  Top 0.305: STM32F4X5RG.BOOT0 68.25,40.92 68.5,40.68 69.45,40.68 69.69,40.92 | STM32F4X5RG.PB5 69.75,40.98 69.69,40.92 | BTN0.P$2 84.85,29.25 v84.37,29.73 | v73.58,31.95 73.58,34.17 69.69,38.06 69.69,40.92
  Bottom 0.254: 82.15,31.95 81.4,31.95 v81.37,31.98
  Bottom 0.305: v84.37,29.73 82.15,31.95 v73.58,31.95
BTN1  (via drill 0.5)
  Top 0.305: R_B1.2 79.15,34.5 77.25,34.5 77,34.75 STM32F4X5RG.PC7
  Top 0.406: BTN1.P$2 87,38.07 v84.37,35.44 | v81.35,35.44 80.09,35.44 R_B1.2
  Bottom 0.406: v84.37,35.44 v81.35,35.44
CAM_CLK  (via drill 0.5)
  Top 0.305: CAM2.5 81.99,52.27 81.99,42.74 81.19,41.95 v81.19,40.84 | v72.94,36.23 73.42,35.75 STM32F4X5RG.PC9
  Bottom 0.305: v81.19,40.84 76.59,36.23 v72.94,36.23
  Bottom 0.813: CAM1.5 CAM2.5
CE  (via drill 0.5)
  Top 0.254: v81.35,25.12 81.35,29.15 79,31.5 79,31.92 76.67,34.25 STM32F4X5RG.PC6
  Top 0.406: HCMS-390X.CE 86.35,20.28 85,21.63 v84.37,21.63
  Bottom 0.406: v84.37,21.63 81.35,24.65 v81.35,25.12
CLK  (via drill 0.5)
  Top 0.254: 76.72,32.75 78,31.47 78,31 79.77,29.23 v79.77,28.46
  Top 0.305: 76.72,32.75 STM32F4X5RG.PB13
  Top 0.406: HCMS-390X.CLK 85.16,12.38 v85.16,19.73
  Bottom 0.305: v85.16,19.73 85.16,23.06 v79.77,28.46
DATA_IN  (via drill 0.5)
  Top 0.305: v78.18,28.62 75.32,31.47 75,31.47 74.53,31.95 74.53,33.54 74.74,33.75 STM32F4X5RG.PB15
  Top 0.406: HCMS-390X.DATA_IN 80.08,12.38 v80.08,16.71
  Bottom 0.406: v80.08,16.71 80.08,22.42 79.61,22.9 79.61,27.19 v78.18,28.62
ENC1A  (via drill 0.5)
  Top 0.305: v63,24 62,25 62,28.4 63.5,29.9 64.4,29.9 66,31.5 66,32.7 65.45,33.25 STM32F4X5RG.PA0_WKUP
  Bottom 0.406: ENC.1 63,19.27 v63,24
ENC1B  (via drill 0.5)
  Top 0.305: v61,27 61,28.5 63.6,31.1 64.7,31.1 65.4,31.8 65.4,32.4 65.05,32.75 STM32F4X5RG.PA1
  Bottom 0.406: ENC.2 64,20.81 64,25 63,26 62,26 v61,27
GND  (via drill 0.5)
  Top 0.305: STM32F4X5RG.PB2 71.75,29.25 72.5,28.5 73.75,28.5 74,28.25 74,27 74.65,26.35 C_VC2.2 C_VD4.2 77.1,26.25 v78.5,26.25 | STM32F4X5RG.VSS_0 66.75,29.25 66.5,29 65.95,29 65,28.05 V_VD3.2 64.95,27.7 v63.6,27.7 | STM32F4X5RG.VSS_1 66.75,43 66.1,43.65 C_VD1.2 64,43.75 v64,45 | C_VB.2 v62,45 | 61.85,43.5 C_VB.2 | C_VB.2 61.65,43.65 60.35,42.35 C9.2 | C_VC1.2 C_VD2.2 | STM32F4X5RG.VSSA 62.5,34.25 62.1,33.85 62.1,33.1 60.5,31.5 59.15,31.5 C_VA2.1 | v81.33,36.71 81.28,36.65 R_B1.1 | R_B0.1 80.06,33.46 v81.33,33.46
  Top 0.406: LED4.C LED3.C LED2.C LED1.C v67,21 | PWR_LED.C v72,5 | v78.5,23.75 78.4,23.65 C31.2 C30.2 | RFB4.1 C8.2 61.35,51.35 v61.5,51.5 | TPS82130_5V.GND_2 52.67,51.67 TPS82130_5V.GND_1 50.58,51.67 C19.2 | C20.2 50.58,42.67 TPS82130_3V3.GND_1 52.67,42.67 TPS82130_3V3.GND_2 | RFB2.1 C9.2 | C_VB.2 63.9,43.65 64,43.75 | R_VMTR-.1 C_VD3.2 | C_VA2.1 C_VA1.1 55.65,31.65 v55.6,31.6 | C_VC1.2 80,43.78 TX-RX-GND-3V3.3
  Top 0.61: RFB5.1 v60,57.75
  Top 0.813: C18.2 58,38.1 | 58,38.1 C17.2 C11.2 C10.2 | v55,37 55,38 | v53,46 C6.2 C7.2 | v55,46 C7.2 | C7.2 C15.2 C16.2 | C13.2 v48,41 | C20.2 v50,41 | v48,50 C14.2 C19.2 v50,50 | 58,38.1 v58,37 C_VD3.2
  Top 2.184: C25.- 39,42.87 | 27.17,54.7 ON<-->OFF.PIN1
  Top 2.54: ON<-->OFF.PIN1 ON<-->OFF.PIN2
  Bottom 0.406: TX-RX-GND-3V3.3 79.29,47.03 79.29,49.57 | SWDIO-GND-SWCLK-3V3.2 77.07,49.89 78.66,49.89
  other vias: 41,43 41,42 41,41 41,40 41,39 37,43 37,42 37,41 37,40 37,39 36,43 36,42 36,41 36,40
  pour Bottom (isolate 0.406): 31,66 93,66 93,-2 61,-2 61,28 31,28
  pour Top (isolate 0.61, rank 4): 15,58 29,58 42,45 42,36 28,36 15,49
IS  (via drill 0.5)
  Top 0.305: STM32F4X5RG.PC2 62.1,35.25 61.45,34.6 61.45,33.2 61,32.75 54,32.75 52.75,34 v52.75,34.75
  Top 0.406: C5.1 27,36 v27.75,35.25
  Top 0.61: BTN8982.P$7 21.88,35.54 22.46,34.97 23.61,34.97 R4.2 C5.1
  Bottom 0.406: v27.75,35.25 28.25,34.75 v52.75,34.75
LED1
  Top 0.305: R_L1.2 67.75,28.4 STM32F4X5RG.PA4
LED2
  Top 0.305: R_L2.2 68.25,28.4 STM32F4X5RG.PA5
LED3
  Top 0.305: R_L3.2 70.15,28.5 69,28.5 68.75,28.75 STM32F4X5RG.PA6
LED4
  Top 0.305: STM32F4X5RG.PA7 69.25,29.25 69.5,29 71,29 72.35,27.65 R_L4.2
MTR  (via drill 0.5)
  Top 0.305: STM32F4X5RG.PA2 63.45,32.25 59.2,28 v58.8,28
  Top 0.406: R1.1 24.89,26.46 41.21,26.46 v42.73,27.98
  Bottom 0.406: v42.73,27.98 v58.8,28
MTR_EN  (via drill 0.5)
  Top 0.305: STM32F4X5RG.PA3 65,29 v64,29
  Top 0.406: R2.1 26,27.34 40.83,27.34 v41.46,27.98
  Bottom 0.406: v41.46,27.98 42.48,29 v64,29
N$1
  Top 0.406: R_PWR.1 73.9,7.75 PWR_LED.A
N$2
  Top 0.305: TPS82130_3V3.SS/TR 54.83,44.75 58.9,44.75 C9.1
N$3
  Top 0.406: BTN8982.P$3 22.54,30.46 23,30 R1.2
N$4
  Top 0.406: R_L1.1 LED1.A
N$5
  Top 0.406: BTN8982.P$4 21.27,31.73 21.75,31.25 23.4,31.25 R2.2 R5.2
N$6
  Top 0.813: BTN8982.P$6 21.73,34.27 22.35,33.65 C4.1 R3.2
N$7
  Top 0.406: R_L2.1 LED2.A
N$8
  Top 0.406: R_L3.1 LED3.A
N$9
  pour Top: 59,61 59,62 arc-90 60,63 76,63 arc-90 77,62 77,61 arc-90 76,60 60,60 arc-90
N$10  (via drill 0.5)
  Top 0.305: MTR.P$8 MTR.P$12 MTR.P$10 MTR.P$14 MTR.P$7 MTR.P$11 MTR.P$9 MTR.P$13 MTR.P$2 | MTR.P$2
  Top 0.813: BTN8982.P$5 BTN8982.P$1 U$4.P$2 | 5.4,22.2 MTR.P$2
  Top 1.778: DIODE.P$1 13.4,5
  Top 3.81: BTN8982.P$1 9,24
  other vias: 2,39 3,39 2,38 3,38 2,37 3,37 2,36 3,36 2,35 3,35 2,34 3,34 2,33 3,33 2,32 3,32 2,31 3,31 2,30 3,30 2,29 3,29 2,28 3,28 2,27 3,27 2,23 2,22 2,21 3,23 3,22 3,21 4,23 4,22 4,21 5,23 5,22 5,21 6,23 6,22 6,21 7,23 7,22 7,21 8,23 8,22 8,21 9,23 9,22 9,21 10,23 10,22 10,21 11,23 11,22 11,21 12,23 12,22 12,21 13,23 13,22 13,21 2,19 2,18 3,18 3,19 4,19 4,18 5,18 5,19 6,19 6,18 2,20 3,20 4,20 5,20 6,20 7,20 7,19 7,18 8,20 8,19 8,18 9,20 9,19 9,18 10,20 10,19 10,18 11,20 11,19 11,18 12,20 12,19 12,18 13,20 13,19 13,18
  pour Top (isolate 0.406, rank 2, no thermals): -1,41 15,41 15,-1 -1,-1
  pour Bottom (isolate 0.406, no thermals): -1,41 5,41 5,24 14,24 14,20 14,-1 -1,-1
N$11
  Top 0.406: R_L4.1 LED4.A
N$16
  Top 0.305: RFB2.2 RFB1.1 55.65,43.65 54.67,42.67 TPS82130_3V3.FB
N$29
  Top 0.406: C8.1 60,52.75 59.25,53.5 54.58,53.5 TPS82130_5V.SS/TR
N$32
  Top 0.305: RFB4.2 RFB3.1 55.65,52.65 54.67,51.67 TPS82130_5V.FB
N$64
  Top 0.305: STM32F4X5RG.VCAP_1 73.25,29.5 73.75,29 74.25,29 75,28.25 C_VC2.1
N$68
  Top 0.305: STM32F4X5RG.VCAP_2 76.59,39.25 77.38,38.46 79.11,38.46 C_VC1.1
NRST  (via drill 0.5)
  Top 0.305: R_NRST.1 60.1,34.35 | 59,34.35 59,36.8 59.4,37.2 61.3,37.2 61.75,36.75 STM32F4X5RG.NRST 69.73,36.75 v71.67,34.81
  Top 0.406: C_VD3.1 59,34.35 R_NRST.1 | RESET.P$2 85,47.26 85,38.93 v84.53,38.46
  Bottom 0.406: v84.53,38.46 83.89,37.82 79.45,37.82 76.43,34.81 v71.67,34.81
OUT_1  (via drill 0.5)
  Top 0.305: STM32F4X5RG.PC5 70.25,31.75 v68.82,33.18 | v72,51 78,51 79.29,52.29 79.29,54.65 CAM1.4
  Bottom 0.305: v68.82,33.18 68.25,33.75 68.25,35.75 71,38.5 71,50 v72,51
OUT_2  (via drill 0.5)
  Top 0.305: STM32F4X5RG.PB1 71.25,33.48 v70.4,34.33
  Bottom 0.305: v70.4,34.33 70.4,35.6 74.21,39.41 74.21,43.22 73.89,43.54 73.89,44.17 74.21,44.49 74.21,49.25 75.8,50.84 78.02,50.84 CAM2.4
RS  (via drill 0.5)
  Top 0.254: STM32F4X5RG.PB14 77,33.25 78.5,31.75 78.5,31.25 80.56,29.19 v80.56,24.17
  Top 0.406: HCMS-390X.RS 82.62,12.38 v82.62,20.99
  Bottom 0.305: v82.62,20.99 82.62,22.11 v80.56,24.17
RX  (via drill 0.5)
  Top 0.305: STM32F4X5RG.PA10 74.78,37.25 74.05,37.98 v74.05,38.14 | v78.66,41.79 78.66,42.11 v77.23,43.54
  Bottom 0.305: v74.05,38.14 77.38,38.14 78.66,39.41 v78.66,41.79 | v77.23,43.54 75.48,45.28 TX-RX-GND-3V3.2
SERVO1  (via drill 0.5)
  Top 0.305: STM32F4X5RG.PB9 67.25,48.01 v67.86,48.62
  Bottom 0.305: SERVO1.1 67.86,54.65 v67.86,48.62
SERVO2  (via drill 0.5)
  Top 0.305: STM32F4X5RG.PB8 67.75,46.92 v68.18,47.35 68.81,47.98 68.81,48.94 67.86,49.89 67.86,52.11 SERVO2.1
SERVO3
  Top 0.305: STM32F4X5RG.PB7 68.75,42.97 68.34,43.38 68.34,46.24 69.45,47.35 69.45,50.52 SERVO3.1
SERVO_EN  (via drill 0.5)
  Top 0.305: STM32F4X5RG.PB3 70.75,44 v69.25,45.5 | TPS82130_5V.EN 54.33,55.35 RFB5.2 60.35,55.35 63,58 65.14,58 v65.32,57.83
  Bottom 0.305: v65.32,57.83 65.32,47.43 66.25,46.5 68.25,46.5 v69.25,45.5
SI  (via drill 0.5)
  Top 0.305: CAM2.6 85.64,52.11 82.78,49.25 v82.78,41.95 | STM32F4X5RG.PC8 76.88,35.25 77.07,35.44 77.07,37.19 77.38,37.5 80.08,37.5 v81.51,38.93
  Bottom 0.305: v81.51,38.93 82.78,40.2 v82.78,41.95
  Bottom 0.813: CAM1.6 CAM2.6
SWCLK
  Top 0.305: STM32F4X5RG.PA14 74.01,41.75 76.75,44.49 76.75,47.03 SWDIO-GND-SWCLK-3V3.3
SWDIO  (via drill 0.5)
  Top 0.305: SWDIO-GND-SWCLK-3V3.1 74.21,47.03 74.21,44.49 v74.84,43.86 | STM32F4X5RG.PA13 74.87,38.75 74.37,39.25 74.37,40.84 v76.11,42.59
  Bottom 0.305: v74.84,43.86 v76.11,42.59
TX  (via drill 0.5)
  Top 0.305: TX-RX-GND-3V3.1 v72.94,43.22 | STM32F4X5RG.PA9 74.33,36.75 72.94,38.14 v72.94,40.05
  Bottom 0.305: v72.94,43.22 v72.94,40.05
V+  (via drill 0.5)
  Top 0.305: BAT.P$13 BAT.P$8 BAT.P$12 BAT.P$10 BAT.P$14 BAT.P$7 BAT.P$11 BAT.P$9
  Top 0.406: TPS82130_3V3.VIN 50,43.33 C20.1 50,43.98 TPS82130_3V3.EN | TPS82130_5V.VIN 50,52.33 C19.1
  Top 0.61: C12.1 21.35,37.65 v21,38 | v48.5,36.5 46,39 46,44 | v53.3,36.5 54,35.8 R_VMTR+.2
  Top 0.813: BTN8982.P$8 18,36.96 v18,38 | v27,22 24.85,22 C1.+ | C25.+ 40.75,52.9 | C14.1 C19.1 | C13.1 C20.1
  Top 1.778: C25.+ 29.15,61 13.4,61 BAT.P$2 5.4,50.6 12,44 20,44 22,42 30,42 38,34 43.15,34
  Top 3.81: 24,22 24.15,22.15 C3.+ 54.5,22.15 54.5,22.25
  Bottom 0.61: v18,38 18,35 27,26 v27,22 | v48.5,36.5 v53.3,36.5
  other vias: 27,23 27,24 27,21 23,21 23,22 23,23 23,24 19,38 20,38 17,38 16,38 17,39 18,39 19,39 20,39 27,25 23,25 28,25 28,24 28,23 28,22 28,21
  pour Top (isolate 0.406): 22,27 53.78,27 53.78,17.75 22,17.75
  pour Top (isolate 0.406, no thermals): 15,36 15,40 20.25,40 22,38.25 22,36
  pour Bottom (isolate 0.305): 15,40 22,40 29,33 29,20 22,20 22,30 15,37
  pour Top (isolate 0.406, rank 3, no thermals): -2,53 13.38,53 18.46,48 30,48 30,43.68 37.68,36 45.75,36 55.75,26 55.75,25 48,25 43,30 35,30 26,39 23,39 21,41 -2,41
  pour Top (isolate 0.406, no thermals): 0.55,52.11 13.25,52.11 13.25,54.65 17.06,58.46 24.68,58.46 28.49,58.46 37.38,49.57 41.19,49.57 41.19,66.08 -3.26,66.08 -3.26,58.46 -3.26,52.11
  pour Top (isolate 0.406, rank 5, no thermals): 52,43 52,55.25 41,55.25 41,43
V-  (via drill 0.5)
  Top 0.305: BAT.P$18 BAT.P$6 | BAT.P$16 BAT.P$4 | BAT.P$17 BAT.P$5 BAT.P$15
  Top 0.406: R5.1 27.35,28.35 29,30 29,35 | 29,35 v29,35.73 29,36.04 27.39,37.65 C5.2 R4.1 24.51,37.65 23.21,36.35 C12.2 | 29,35 26.35,32.35 R3.1 C4.2
  Top 1.778: DIODE.P$2 20.3,5.3
  Bottom 0.305: 15,15 MTR.P$4 MTR.P$16 | MTR.P$17 15,13 | MTR.P$5 15,11 MTR.P$15 MTR.P$3 MTR.P$18 MTR.P$6
  other vias: 23,14 23,13 23,12 23,11 27,14 27,13 27,12 27,11 38,14 38,13 38,12 38,11 42,14 42,13 42,12 42,11 53,14 53,13 53,12 53,11 57,14 57,13 57,12 57,11 27,15 23,15 38,15 42,15 53,15 57,15 22,7 22,6 22,5 22,4
  pour Bottom (isolate 0.406, rank 3, no thermals): -4,65 29.75,65 29.75,26.75 59.75,26.75 59.75,-3 -4,-3
  pour Top (isolate 0.406): 17,9 60,9 60,16.5 17,16.5
  pour Top (isolate 0.406, no thermals): 15,30 20.73,30 20.73,17 20.75,15 17,15 15,17
  pour Top (isolate 0.406, no thermals): 19,7.75 23,7.75 23,-1 19,-1
VMTR
  Top 0.305: R_VMTR-.2 56.85,33.5 60.75,33.5 60.9,33.65 60.9,35.4 61.75,36.25 STM32F4X5RG.PC0
  Top 0.406: R_VMTR+.1 R_VMTR-.2

### Text on the board
tNames: GND-5V-SERVO
tKeepout: Designed by Kevin Tain / 06-01-17